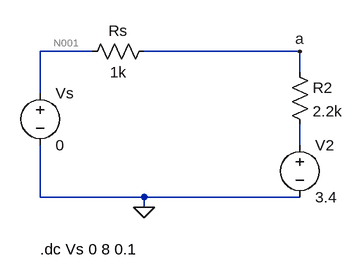
[diagram p0: schematic circuit2.asc]
circuit2.asc, the LTspice schematic file:
Version 4
SHEET 1 880 680
WIRE -640 -352 -720 -352
WIRE -320 -352 -560 -352
WIRE -320 -320 -320 -352
WIRE -720 -288 -720 -352
WIRE -320 -208 -320 -240
WIRE -720 -128 -720 -208
WIRE -560 -128 -720 -128
WIRE -320 -128 -560 -128
WIRE -560 -112 -560 -128
FLAG -560 -112 0
FLAG -320 -352 a
SYMBOL voltage -720 -304 R0
SYMATTR InstName Vs
SYMATTR Value 0
SYMBOL voltage -320 -224 R0
SYMATTR InstName V2
SYMATTR Value 3.4
SYMBOL res -656 -336 R270
WINDOW 0 32 56 VTop 2
WINDOW 3 0 56 VBottom 2
SYMATTR InstName Rs
SYMATTR Value 1k
SYMBOL res -336 -336 R0
SYMATTR InstName R2
SYMATTR Value 2.2k
TEXT -720 -48 Left 2 !.dc Vs 0 8 0.1

The netlist it stands for:
* circuit2.asc
Vs N001 0 0
V2 N002 0 3.4
Rs N001 a 1k
R2 a N002 2.2k
.dc Vs 0 8 0.1
.backanno
.end

* Results of the author's LTspice run, read from the files saved beside the schematic
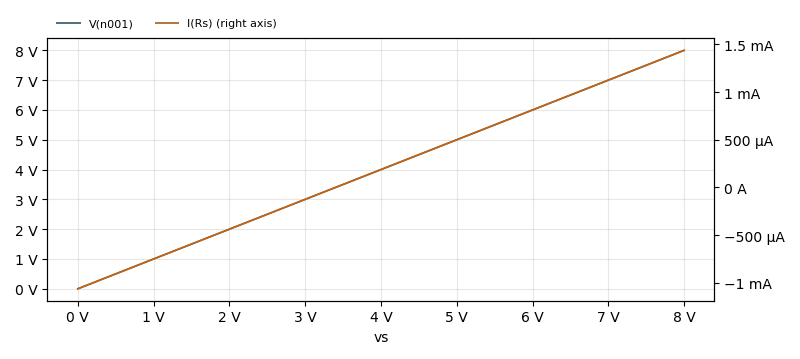
[diagram p1: DC transfer characteristic of circuit2.asc, plotted from the saved traces]
* DC transfer characteristic, 1 run:
*   V(n001): 0 V at vs=0 V, 8 V at vs=8 V, min 0 V, max 8 V
*   I(Rs): -1.063 mA at vs=0 V, 1.438 mA at vs=8 V, min -1.063 mA, max 1.438 mA